# Altium schematic sheet STM32_microcontroller_power.SchDoc: STM32_microcontroller_power
size A4; Date: Not used; ApprovedBy: Not used; CheckedBy: Not used; Author: Not used; CompanyName: STMicroelectronics; DrawnBy: Not used; Engineer: Not used; Organization: Not used; Address1: Not used; Address2: Not used; Address3: Not used; Address4: Not used; DocumentNumber: Not used; Revision: Not used; SheetNumber: 4; SheetTotal: 22; CurrentTime: Not used; CurrentDate: Not used; Time: Not used; DocumentFullPathAndName: Not used; DocumentName: Not used; ModifiedDate: Not used; ImagePath: Not used; ProjectName: Not used; Application_BuildNumber: Not used
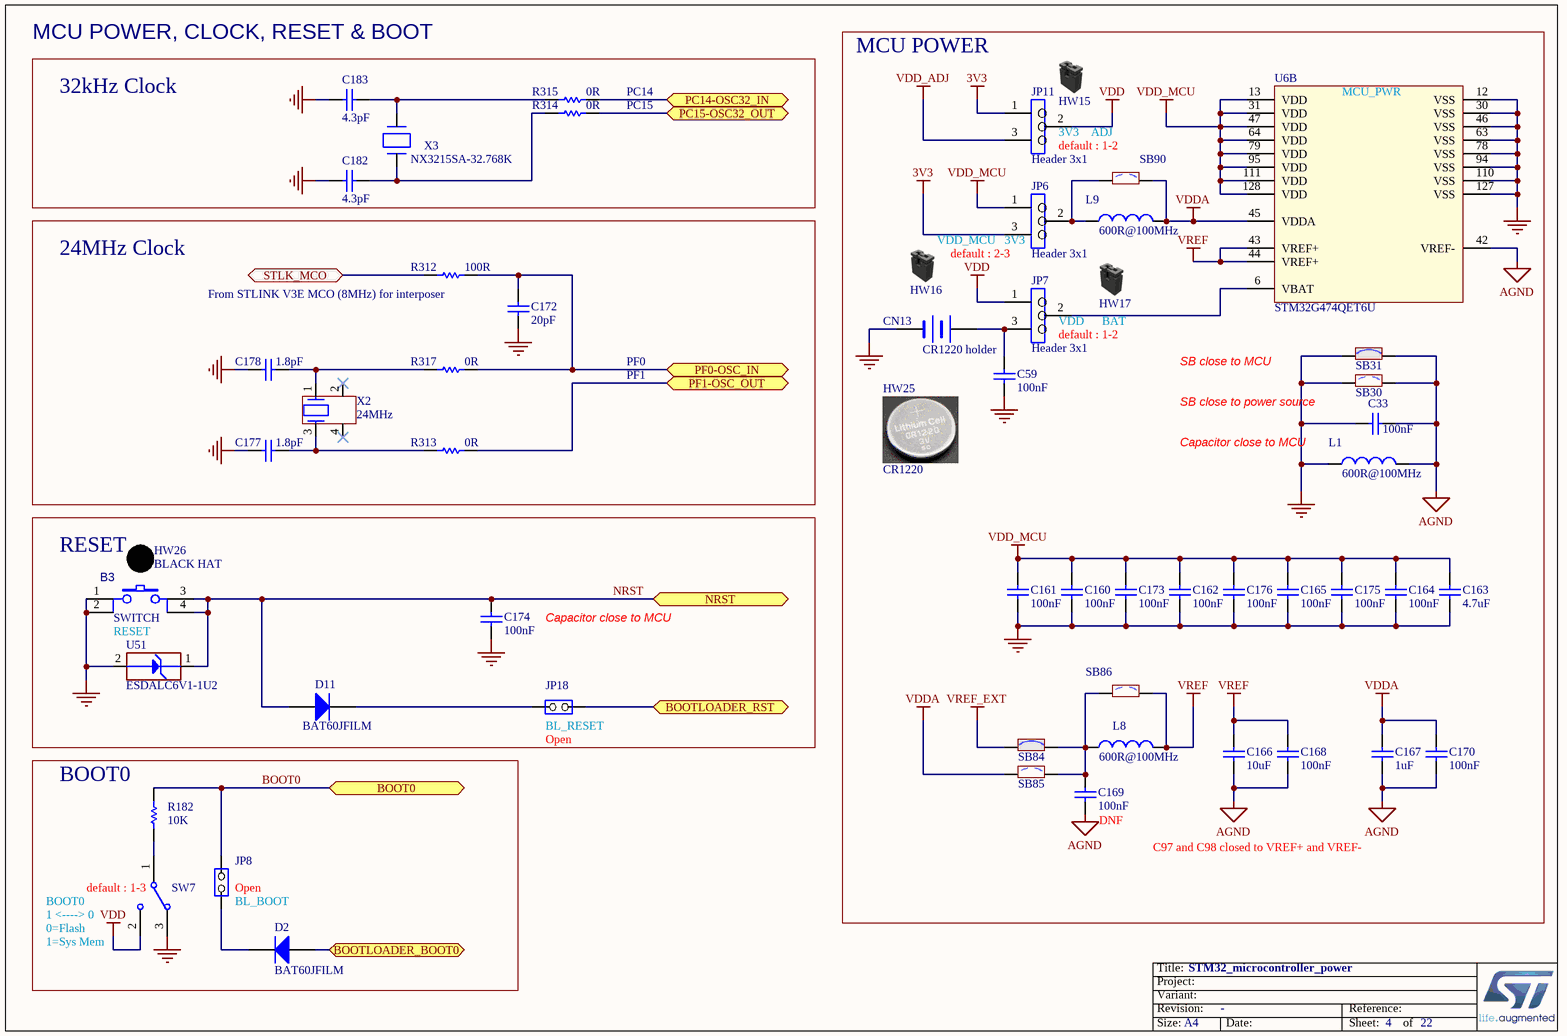
[diagram p0: STM32_microcontroller_power.SchDoc]

## Parts
B3  value SWITCH  [SWI_WEALTHMETAL_TD-0341_4P_BLACK]  (hidden comment: SW-PUSH-CMS)
C33  value 100nF  [C0402]  (hidden comment: Capacitor)
C59  value 100nF  [C0402]  (hidden comment: Capacitor)
C160  value 100nF  [C0402]  (hidden comment: Capacitor)
C161  value 100nF  [C0402]  (hidden comment: Capacitor)
C162  value 100nF  [C0402]  (hidden comment: Capacitor)
C163  value 4.7uF  [C0603]  (hidden comment: Capacitor)
C164  value 100nF  [C0402]  (hidden comment: Capacitor)
C165  value 100nF  [C0402]  (hidden comment: Capacitor)
C166  value 10uF  [C0805]  (hidden comment: Capacitor)
C167  value 1uF  [C0603]  (hidden comment: Capacitor)
C168  value 100nF  [C0402]  (hidden comment: Capacitor)
C169  value 100nF  [C0402]  (hidden comment: Capacitor)
C170  value 100nF  [C0402]  (hidden comment: Capacitor)
C172  value 20pF  [C0402]  (hidden comment: Capacitor)
C173  value 100nF  [C0402]  (hidden comment: Capacitor)
C174  value 100nF  [C0402]  (hidden comment: Capacitor)
C175  value 100nF  [C0402]  (hidden comment: Capacitor)
C176  value 100nF  [C0402]  (hidden comment: Capacitor)
C177  value 1.8pF  [C0402]  (hidden comment: Capacitor)
C178  value 1.8pF  [C0402]  (hidden comment: Capacitor)
C182  value 4.3pF  [C0402]  (hidden comment: Capacitor)
C183  value 4.3pF  [C0402]  (hidden comment: Capacitor)
CN13  value CR1220 holder  [BAT_HARWIN_S8411-45R_SMD_2P]  (hidden comment: BATTERY HOLDER)
D2  BAT60JFILM  [DIO_SOD323]
D11  BAT60JFILM  [DIO_SOD323]
HW15  Shunt Black 2.54mm  (value not drawn)  (mechanical)
HW16  Shunt Black 2.54mm  (value not drawn)  (mechanical)
HW17  Shunt Black 2.54mm  (value not drawn)  (mechanical)
HW25  value CR1220  (hidden comment: BBU_CR1220)  (mechanical)
HW26  value BLACK HAT  (hidden comment: BUTTON_HAT_BLACK)  (mechanical)
JP6  value Header 3x1  [CON_SAMTEC_TSW-103-07-F-S]  (hidden comment: Jumper_Header 3x1)
JP7  value Header 3x1  [CON_SAMTEC_TSW-103-07-F-S]  (hidden comment: Jumper_Header 3x1)
JP8  Jumper_Header 2x1  [CON_SAMTEC_TSW-102-07-G-S]  (value not drawn)
JP11  value Header 3x1  [CON_SAMTEC_TSW-103-07-F-S]  (hidden comment: Jumper_Header 3x1)
JP18  Jumper_Header 2x1  [CON_SAMTEC_TSW-102-07-G-S]  (value not drawn)
L1  value 600R@100MHz  [L0603]  (hidden comment: BEAD)
L8  value 600R@100MHz  [L0603]  (hidden comment: BEAD)
L9  value 600R@100MHz  [L0603]  (hidden comment: BEAD)
R182  value 10K  [R0402]  (hidden comment: Resistor)
R312  value 100R  [R0402]  (hidden comment: Resistor)
R313  value 0R  [R0402]  (hidden comment: Resistor)
R314  value 0R  [R0402]  (hidden comment: Resistor)
R315  value 0R  [R0402]  (hidden comment: Resistor)
R317  value 0R  [R0402]  (hidden comment: Resistor)
SB30  SB_OFF  [SOLDER-BRIDGE_R0603-0R]  (value not drawn)
SB31  SB_ON  [SOLDER-BRIDGE_R0603-0R]  (value not drawn)
SB84  SB_ON  [SOLDER-BRIDGE_R0603-0R]  (value not drawn)
SB85  SB_OFF  [SOLDER-BRIDGE_R0603-0R]  (value not drawn)
SB86  SB_OFF  [SOLDER-BRIDGE_R0603-0R]  (value not drawn)
SB90  SB_OFF  [SOLDER-BRIDGE_R0603-0R]  (value not drawn)
SW7  SW_MECA_1K2  [SWI_EAO_09-03290-01_EXTENDED_STRAIGHT_BLACK]  (value not drawn)
U6  STM32G474QET6U  [ICC_LQFP128_14X14_P040]  (part B of 2)
U51  value ESDALC6V1-1U2  [ESD_ST0201]  (hidden comment: ESD-TRANSIL)
X2  value 24MHz  [CRY_NX2016SA_4P]  (hidden comment: XTAL_4_PINS)
X3  value NX3215SA-32.768K  [CRY_NX3215SA_2P]  (hidden comment: XTAL_2_PINS)

## Blocks framed on the sheet
MCU POWER: C33 C59 C160-C170 C173 C175 C176 CN13 HW15-HW17 HW25 JP6 JP7 JP11 L1 L8 L9 SB30 SB31 SB84-SB86 SB90 U6
24MHz Clock: C172 C177 C178 R312 R313 R317 X2
RESET: B3 C174 D11 HW26 JP18 U51
BOOT0: D2 JP8 R182 SW7

## Ports
BOOT0, BOOTLOADER_BOOT0, BOOTLOADER_RST, NRST, PC14-OSC32_IN, PC15-OSC32_OUT, PF0-OSC_IN, PF1-OSC_OUT, STLK_MCO

## Nets
3V3: JP6.3 JP11.1
AGND: C33.1 C166.1 C167.2 C168.1 C169.1 C170.1 L1.2 SB30.2 SB31.2 U6.42(VREF-)
GND: B3.1 B3.2 C33.2 C59.1 C160.1 C161.1 C162.1 C163.2 C164.1 C165.1 C172.2 C173.1 C174.1 C175.1 C176.1 C177.1 C178.1 C182.1 C183.1 CN13.2(-) L1.1 SB30.1 SB31.1 SW7.3 U6.12(VSS) U6.30(VSS) U6.46(VSS) U6.63(VSS) U6.78(VSS) U6.94(VSS) U6.110(VSS) U6.127(VSS) U51.2(GND)
VDD: JP7.1 JP11.2 SW7.2
VDD_ADJ: JP11.3
VDD_MCU: C160.2 C161.2 C162.2 C163.1 C164.2 C165.2 C173.2 C175.2 C176.2 JP6.1 U6.13(VDD) U6.31(VDD) U6.47(VDD) U6.64(VDD) U6.79(VDD) U6.95(VDD) U6.111(VDD) U6.128(VDD)
VDDA: C167.1 C170.2 L9.2 SB85.1 SB90.2 U6.45(VDDA)
VREF: C166.2 C168.2 L8.2 SB86.2 U6.43(VREF+) U6.44(VREF+)
VREF_EXT: SB84.1
BOOT0: JP8.2(NO) R182.1 ; port BOOT0
BOOTLOADER_BOOT0: D2.1(A) ; port BOOTLOADER_BOOT0
BOOTLOADER_RST: JP18.2(NO) ; port BOOTLOADER_RST
NRST: B3.3 B3.4 C174.2 D11.1(A) U51.1(IO1) ; port NRST
PC14-OSC32_IN: R315.2 ; port PC14-OSC32_IN
PC15-OSC32_OUT: R314.2 ; port PC15-OSC32_OUT
PF0-OSC_IN: C172.1 R312.2 R317.2 ; port PF0-OSC_IN
PF1-OSC_OUT: R313.2 ; port PF1-OSC_OUT
STLK_MCO: R312.1 ; port STLK_MCO
NetC59_2: C59.2 CN13.1(+) JP7.3
NetC169_2: C169.2 L8.1 SB84.2 SB85.2 SB86.1
NetC177_2: C177.2 R313.1 X2.3
NetC178_2: C178.2 R317.1 X2.1
NetC182_2: C182.2 R314.1 X3.1(X1)
NetC183_2: C183.2 R315.1 X3.2(X2)
NetD2_2: D2.2(K) JP8.1(COMMON)
NetD11_2: D11.2(K) JP18.1(COMMON)
NetJP6_2: JP6.2 L9.1 SB90.1
NetJP7_2: JP7.2 U6.6(VBAT)
NetR182_2: R182.2 SW7.1

Not connected (* = marked no-connect by the designer): X2 2* 4*

## Notes on the sheet
- MCU POWER, CLOCK, RESET & BOOT
- 32kHz Clock
- PC14
- PC15
- (near JP11) default : 1-2
- (near JP11) 3V3    ADJ
- VDD_MCU   3V3
- (near R312) From STLINK V3E MCO (8MHz) for interposer
- (near JP6) default : 2-3
- PF0
- PF1
- (near JP7) default : 1-2
- (near JP7) VDD      BAT
- SB close to MCU
- (near L1) Capacitor close to MCU
- SB close to power source
- (near B3) RESET
- Capacitor close to MCU
- (near JP18) Open
- (near JP18) BL_RESET
- (near C169) DNF
- C97 and C98 closed to VREF+ and VREF-
- BOOT0
- (near SW7) 1 <----> 0
- (near SW7) default : 1-3
- (near JP8) Open
- (near JP8) BL_BOOT
- (near SW7) 0=Flash
- (near SW7) 1=Sys Mem
- Title:
- Project:
- Size:
- Revision:
- Variant:
- A4
- -
- Date:
- Reference:
- Sheet:
- of
- (in symbol MCD-01707, part B) MCU_PWR

## Library data of the parts
B3 = MCD-00001: Non-Open Push-Button 0.1A 24V BLACK; Manufacturer_Part_Number: TD-0341; Manufacturer: WEALTHMETAL; Part_Type: Misc; Provided_By: SUBCO; Initial_Board_Reference: MB1274; Remark: update MPN removed color, as it is done by HAT, removed Farnell code as it is not good; Path: ws/MCD_ApplicationBoards/Lists/MCDPARTSdatabase; Item Type: Item; Internal_Part_Number: MCD-00001; ComponentLink1Description: Datasheet; Status: Released; ComponentLink1URL: http://tunmcdsvn.tun.st.com/Component_Datasheet_Library/Trunk/Misc/Wealthmetal_Tact-Switch_TD0341
C33 C59 C160-C162 C164 C165 C168-C170 C173-C176 = MCD-00006: Capacitor, MLCC, 100nF, 16V, X7R, 10%, 0402, T=0.5mm; Manufacturer_Part_Number: CC0402KRX7R7BB104; Manufacturer: YAGEO; Alternate_Manufacturer_Part_Number: GCM155R71C104KA55D; Alternate_Manufacturer: MURATA; Provided_By: SUBCO; Initial_Board_Reference: MB1274; Path: ws/MCD_ApplicationBoards/Lists/MCDPARTSdatabase; Item Type: Item; Internal_Part_Number: MCD-00006; Status: Released; Part_Type: Capacitor; Package: C0402; ComponentLink1Description: Datasheet; ComponentLink1URL: http://tunmcdsvn.tun.st.com/Component_Datasheet_Library/Trunk/Capacitors/Yageo_Multilayer_Capacitor_X7R_series_100pF_to_22uF
C163 = MCD-00009: Capacitor, MLCC, 4.7uF, 16V, X5R, 10%, 0603, T=0.8mm; Manufacturer_Part_Number: CC0603KRX5R7BB475; Manufacturer: YAGEO; Provided_By: SUBCO; Initial_Board_Reference: MB1274; Path: ws/MCD_ApplicationBoards/Lists/MCDPARTSdatabase; Item Type: Item; Internal_Part_Number: MCD-00009; Status: Released; Part_Type: Capacitor; ComponentLink1Description: Datasheet; ComponentLink1URL: http://tunmcdsvn.tun.st.com/Component_Datasheet_Library/Trunk/Capacitors/Yageo_Multilayer_capacitor_X5R_series_100pF_to_100uF; Package: C0603
C166 = MCD-00014: Capacitor, MLCC, 10uF, 25V, X5R, 10%, 0805, T=0,85mm; Manufacturer_Part_Number: CC0805KRX5R8BB106; Manufacturer: YAGEO; Provided_By: SUBCO; Initial_Board_Reference: MB1274; Path: ws/MCD_ApplicationBoards/Lists/MCDPARTSdatabase; Item Type: Item; Internal_Part_Number: MCD-00014; ComponentLink1Description: Datasheet; Status: Released; Part_Type: Capacitor; Package: C0805; ComponentLink1URL: http://tunmcdsvn.tun.st.com/Component_Datasheet_Library/Trunk/Capacitors/Yageo_Multilayer_capacitor_X5R_series_100pF_to_100uF
C167 = MCD-00010: Capacitor, MLCC, 1uF, 16V, X5R, 10%, 0603, T=0,8mm; Manufacturer_Part_Number: CC0603KRX5R7BB105; Manufacturer: YAGEO; Provided_By: SUBCO; Initial_Board_Reference: MB1274; Path: ws/MCD_ApplicationBoards/Lists/MCDPARTSdatabase; Item Type: Item; Internal_Part_Number: MCD-00010; Status: Released; Part_Type: Capacitor; ComponentLink1Description: Datasheet; ComponentLink1URL: http://tunmcdsvn.tun.st.com/Component_Datasheet_Library/Trunk/Capacitors/Yageo_Multilayer_capacitor_X5R_series_100pF_to_100uF; Package: C0603
C172 = MCD-00016: Capacitor, MLCC, 20pF, 50V, NPO, 5%, 0402, T=0,5mm; Manufacturer_Part_Number: CC0402JRNPO9BN200; Manufacturer: YAGEO; Provided_By: SUBCO; Initial_Board_Reference: MB1274; Path: ws/MCD_ApplicationBoards/Lists/MCDPARTSdatabase; Item Type: Item; Internal_Part_Number: MCD-00016; Status: Released; Package: C0402; ComponentLink1Description: Datasheet; Part_Type: Capacitor; ComponentLink1URL: http://tunmcdsvn.tun.st.com/Component_Datasheet_Library/Trunk/Capacitors/Yageo_Capacitor_NP0_16V-to-50V
C177 C178 = MCD-01598: Capacitor, MLCC, 1.8pF, 50V, NPO, +-0.25pF, 0402, T=0,5mm; Manufacturer_Part_Number: CC0402CRNPO9BN1R8; Manufacturer: YAGEO; Provided_By: SUBCO; Internal_Part_Number: MCD-01598; Status: Released; Part_Type: Capacitor; Package: C0402; ComponentLink1Description: Datasheet; ComponentLink1URL: http://tunmcdsvn.tun.st.com/Component_Datasheet_Library/Trunk/Capacitors/Yageo_Capacitor_NP0_16V-to-50V
C182 C183 = MCD-01706: Capacitor, MLCC, 4.3pF, 50V, NPO, +-0.25pF, 0402, T=0,5mm; Manufacturer_Part_Number: CC0402CRNPO9BN4R3; Manufacturer: YAGEO; Provided_By: SUBCO; Internal_Part_Number: MCD-01706; Status: Footprint available; Part_Type: Capacitor; Package: C0402; ComponentLink1Description: Datasheet; ComponentLink1URL: http://tunmcdsvn.tun.st.com/Component_Datasheet_Library/Trunk/Capacitors/Yageo_Capacitor_NP0_16V-to-50V
CN13 = MCD-00558: Battery Coin Cell holder, CR1220_12mm, Height 4.25mm; Part_Type: Connector; Manufacturer_Part_Number: S8411-45R; Manufacturer: HARWIN; Provided_By: SUBCO; Initial_Board_Reference: MB1331; Path: ws/MCD_ApplicationBoards/Lists/MCDPARTSdatabase; Item Type: Item; Internal_Part_Number: MCD-00558; Status: Released; ComponentLink1Description: Datasheet; ComponentLink1URL: http://tunmcdsvn.tun.st.com/Component_Datasheet_Library/Trunk/Connectors/Harwin_S8_series
D2 D11 = MCD-00034: Manufacturer: STMICROELECTRONICS; Part_Type: Diode; BMS_Part_Number: 9151097; Provided_By: SUBCO with ST control; Initial_Board_Reference: MB1274; Path: ws/MCD_ApplicationBoards/Lists/MCDPARTSdatabase; Item Type: Item; Internal_Part_Number: MCD-00034; Value: BAT60JFILM; Manufacturer_Part_Number: BAT60JFILM; ComponentLink1Description: Datasheet; Status: Released; ComponentLink1URL: http://tunmcdsvn.tun.st.com/Component_Datasheet_Library/Trunk/Diodes/STM_Diode_BAT60JFILM-SOD323
HW15-HW17 = MCD-00043: SHUNT 2.54mm BLACK; Part_Type: Mechanical; Manufacturer_Part_Number: SNT-100-BK-G; Manufacturer: SAMTEC; Provided_By: SUBCO; Initial_Board_Reference: MB1274; Value: SNT-100-BK-G; Path: ws/MCD_ApplicationBoards/Lists/MCDPARTSdatabase; Item Type: Item; Internal_Part_Number: MCD-00043; Status: Released; ComponentLink1Description: Datasheet; ComponentLink1URL: http://tunmcdsvn.tun.st.com/Component_Datasheet_Library/Trunk/Connectors/Samtec_Shunt_Jumper_SNT100
HW25 = MCD-01197: Battery Back-Up CR1220,3V,12X2.0MM,35mA; Part_Type: Misc; Manufacturer: tbd; Alternate_Manufacturer_Part_Number: 988.16.04.2.00003; Alternate_Manufacturer: Jiubaba; Provided_By: SUBCO; Initial_Board_Reference: MB1372; Remark: Mechanical part, no footprint.; Path: ws/MCD_ApplicationBoards/Lists/MCDPARTSdatabase; Item Type: Item; Internal_Part_Number: MCD-01197; Status: Checked; Manufacturer_Part_Number: CR1220; Package: CR1220; ComponentLink1Description: Datasheet; ComponentLink1URL: http://na
HW26 = MCD-00635: Black Hat for switch TD0341X-G01-BLA; Part_Type: Mechanical; Manufacturer_Part_Number: 988.16.09.3.00003_SH-517; Manufacturer: JIUBABA; Provided_By: SUBCO; Initial_Board_Reference: MB1319; Item Type: Item; Path: ws/MCD_ApplicationBoards/Lists/MCDPARTSdatabase; Internal_Part_Number: MCD-00635; Status: Released; ComponentLink1Description: Datasheet; ComponentLink1URL: http://tunmcdsvn.tun.st.com/Component_Datasheet_Library/Trunk/Mechanical/Jiubaba_HAT_SH-517
JP6 JP7 JP11 = MCD-00111: Header, 3x1, 2,54mm, VR, TH, Height 5.84mm/2.54mm; Part_Type: Connector; Manufacturer_Part_Number: TSW-103-07-F-S; Manufacturer: SAMTEC; Provided_By: SUBCO; Initial_Board_Reference: MB1262; Path: ws/MCD_ApplicationBoards/Lists/MCDPARTSdatabase; Item Type: Item; Internal_Part_Number: MCD-00111; Status: Released; ComponentLink1Description: Datasheet; ComponentLink1URL: http://tunmcdsvn.tun.st.com/Component_Datasheet_Library/Trunk/Connectors/Samtec_TSW-HTSW-series
JP8 JP18 = MCD-00045: Header, 2x1, 2,54mm, VR, TH, Height 5.84mm/2.54mm; Manufacturer_Part_Number: TSW-102-07-x-S; Manufacturer: SAMTEC; Part_Type: Connector; Value: Shunt not fitted; Provided_By: SUBCO; Initial_Board_Reference: MB1274; Path: ws/MCD_ApplicationBoards/Lists/MCDPARTSdatabase; Item Type: Item; Internal_Part_Number: MCD-00045; ComponentLink1Description: Datasheet; Status: Released; ComponentLink1URL: http://tunmcdsvn.tun.st.com/Component_Datasheet_Library/Trunk/Connectors/Samtec_TSW-HTSW-series
L1 L8 L9 = MCD-00047: SMD Chip ferrite bead, 600R@100MHz +/-25%, 350mA, 500mohm DC, 0603, T=0.8mm; Part_Type: Inductor; Manufacturer_Part_Number: FCM1608KF-601T03; Manufacturer: TAI-TECH; Provided_By: SUBCO; Initial_Board_Reference: MB1274; Path: ws/MCD_ApplicationBoards/Lists/MCDPARTSdatabase; Item Type: Item; Internal_Part_Number: MCD-00047; Status: Released; ComponentLink1Description: Datasheet; ComponentLink1URL: http://tunmcdsvn.tun.st.com/Component_Datasheet_Library/Trunk/Inductors/TaiTech_Bead_FCM1608_series
R182 = MCD-00053: Resistor,10K,0402,1%,1/16W; Manufacturer_Part_Number: RC0402FR-0710KL; Manufacturer: YAGEO; Provided_By: SUBCO; Initial_Board_Reference: MB1274; Path: ws/MCD_ApplicationBoards/Lists/MCDPARTSdatabase; Item Type: Item; Internal_Part_Number: MCD-00053; ComponentLink1Description: Datasheet; Status: Released; Part_Type: Resistor; Package: R0402; ComponentLink1URL: http://tunmcdsvn.tun.st.com/Component_Datasheet_Library/Trunk/Resistors/Yageo_Resistor_RC0402-series
R312 = MCD-00119: Resistor,100R,0402,1%,1/16W; Manufacturer_Part_Number: RC0402FR-07100RL; Manufacturer: YAGEO; Provided_By: SUBCO; Initial_Board_Reference: MB1262; Path: ws/MCD_ApplicationBoards/Lists/MCDPARTSdatabase; Item Type: Item; Internal_Part_Number: MCD-00119; Status: Released; Part_Type: Resistor; ComponentLink1Description: Datasheet; Package: R0402; ComponentLink1URL: http://tunmcdsvn.tun.st.com/Component_Datasheet_Library/Trunk/Resistors/Yageo_Resistor_RC0402-series
R313-R315 R317 = MCD-00052: Resistor,0R,0402,5%,1/16W; Manufacturer_Part_Number: RC0402JR-070RL; Manufacturer: YAGEO; Provided_By: SUBCO; Initial_Board_Reference: MB1274; Path: ws/MCD_ApplicationBoards/Lists/MCDPARTSdatabase; Item Type: Item; Internal_Part_Number: MCD-00052; Status: Released; Part_Type: Resistor; Package: R0402; ComponentLink1Description: Datasheet; ComponentLink1URL: http://tunmcdsvn.tun.st.com/Component_Datasheet_Library/Trunk/Resistors/Yageo_Resistor_RC0402-series
SB30 SB85 SB86 SB90 = MCD-00072: Solder Bridge OFF; Part_Type: Mechanical; Manufacturer_Part_Number: RC0603JR-070RL; Manufacturer: YAGEO; Provided_By: SUBCO; Initial_Board_Reference: MB1274; Path: ws/MCD_ApplicationBoards/Lists/MCDPARTSdatabase; Item Type: Item; Internal_Part_Number: MCD-00072; Status: Released; ComponentLink1Description: Datasheet; Package: SB0603; ComponentLink1URL: http://tunmcdsvn.tun.st.com/Component_Datasheet_Library/Trunk/Resistors/Yageo_Resistor_RC0603-series
SB31 SB84 = MCD-00071: Solder Bridge ON; Part_Type: Mechanical; Manufacturer_Part_Number: RC0603JR-070RL; Manufacturer: YAGEO; Provided_By: SUBCO; Initial_Board_Reference: MB1274; Path: ws/MCD_ApplicationBoards/Lists/MCDPARTSdatabase; Item Type: Item; Internal_Part_Number: MCD-00071; Status: Released; ComponentLink1Description: Datasheet; Package: SB0603; ComponentLink1URL: http://tunmcdsvn.tun.st.com/Component_Datasheet_Library/Trunk/Resistors/Yageo_Resistor_RC0603-series
SW7 = MCD-00566: Mechanical Slide Switches 1K2 BLK ACT GOLD STRT MNT; Part_Type: Misc; Manufacturer_Part_Number: 09.03290.01; Manufacturer: EAO; Value: Mechanical Slide Switch 1K2; Provided_By: SUBCO; Initial_Board_Reference: MB1331; Path: ws/MCD_ApplicationBoards/Lists/MCDPARTSdatabase; Item Type: Item; Internal_Part_Number: MCD-00566; Status: Checked; ComponentLink1Description: Datasheet; ComponentLink1URL: http://tunmcdsvn.tun.st.com/Component_Datasheet_Library/Trunk/Misc/EAO_SWITCH_09.03290.01
U6 = MCD-01707: ARM® Cortex®-M4 32-bit MCU, 512 KB Flash, 96 KB RAM, 5x USART, timers, ADC, DAC, comm. I/F, 1.65-3.6V; Part_Type: IC; Manufacturer: STMICROELECTRONICS; Provided_By: SUBCO with ST control; Internal_Part_Number: MCD-01707; Value: STM32G474QET6U; Status: Released; Manufacturer_Part_Number: STM32G474QET6U; Package: LQFP128; ComponentLink1Description: Datasheet; ComponentLink1URL: http://tunmcdsvn.tun.st.com/Component_Datasheet_Library/Trunk/IC/STM_MCU_STM32G474WET6
U51 = MCD-00170: ESD protection 6V1; Part_Type: Diode; Manufacturer: STMICROELECTRONICS; BMS_Part_Number: 9151132; Provided_By: SUBCO with ST control; Initial_Board_Reference: MB1274; Path: ws/MCD_ApplicationBoards/Lists/MCDPARTSdatabase; Item Type: Item; Internal_Part_Number: MCD-00170; Status: Released; Manufacturer_Part_Number: ESDALC6V1-1U2; ComponentLink1Description: Datasheet; ComponentLink1URL: http://tunmcdsvn.tun.st.com/Component_Datasheet_Library/Trunk/Diodes/STM_ESD_ESDALC6V1-1U2
X2 = MCD-01036: 24MHz crystal oscillator - Cl:6pf -; Part_Type: Crystal_Osc; Manufacturer_Part_Number: NX2016SA 24MHz EXS00A-CS10820; Manufacturer: NDK; BMS_Part_Number: 9157045; Provided_By: ST; Initial_Board_Reference: MB1332; Path: ws/MCD_ApplicationBoards/Lists/MCDPARTSdatabase; Item Type: Item; Internal_Part_Number: MCD-01036; Status: Checked; Package: (2016) 2.0 x 1.6 x 0.45 mm; ComponentLink1Description: Datasheet; ComponentLink1URL: http://tunmcdsvn.tun.st.com/Component_Datasheet_Library/Trunk/Crystal_Osc/NDK_NX2016SA 24MHz EXS00A-CS10820 (EXS10B-27366B)
X3 = MCD-00091: Crystal 32.768kHz, 6pF, -+20PPM, R=50K, SMD; Part_Type: Crystal_Osc; Manufacturer_Part_Number: NX3215SA 32.768KHz EXS00A-MU00525; Manufacturer: NDK; BMS_Part_Number: 9157034; Provided_By: ST; Initial_Board_Reference: MB1274; Path: ws/MCD_ApplicationBoards/Lists/MCDPARTSdatabase; Item Type: Item; Internal_Part_Number: MCD-00091; Status: Released; ComponentLink1Description: Datasheet; ComponentLink1URL: http://tunmcdsvn.tun.st.com/Component_Datasheet_Library/Trunk/Crystal_Osc/NDK_Crystal-For-ST_NX3215SA 32.768KHz EXS00A-MU00525 (EXS10B-21238)